# Altium project NA61_BPD_FEE_eval.PrjPcb
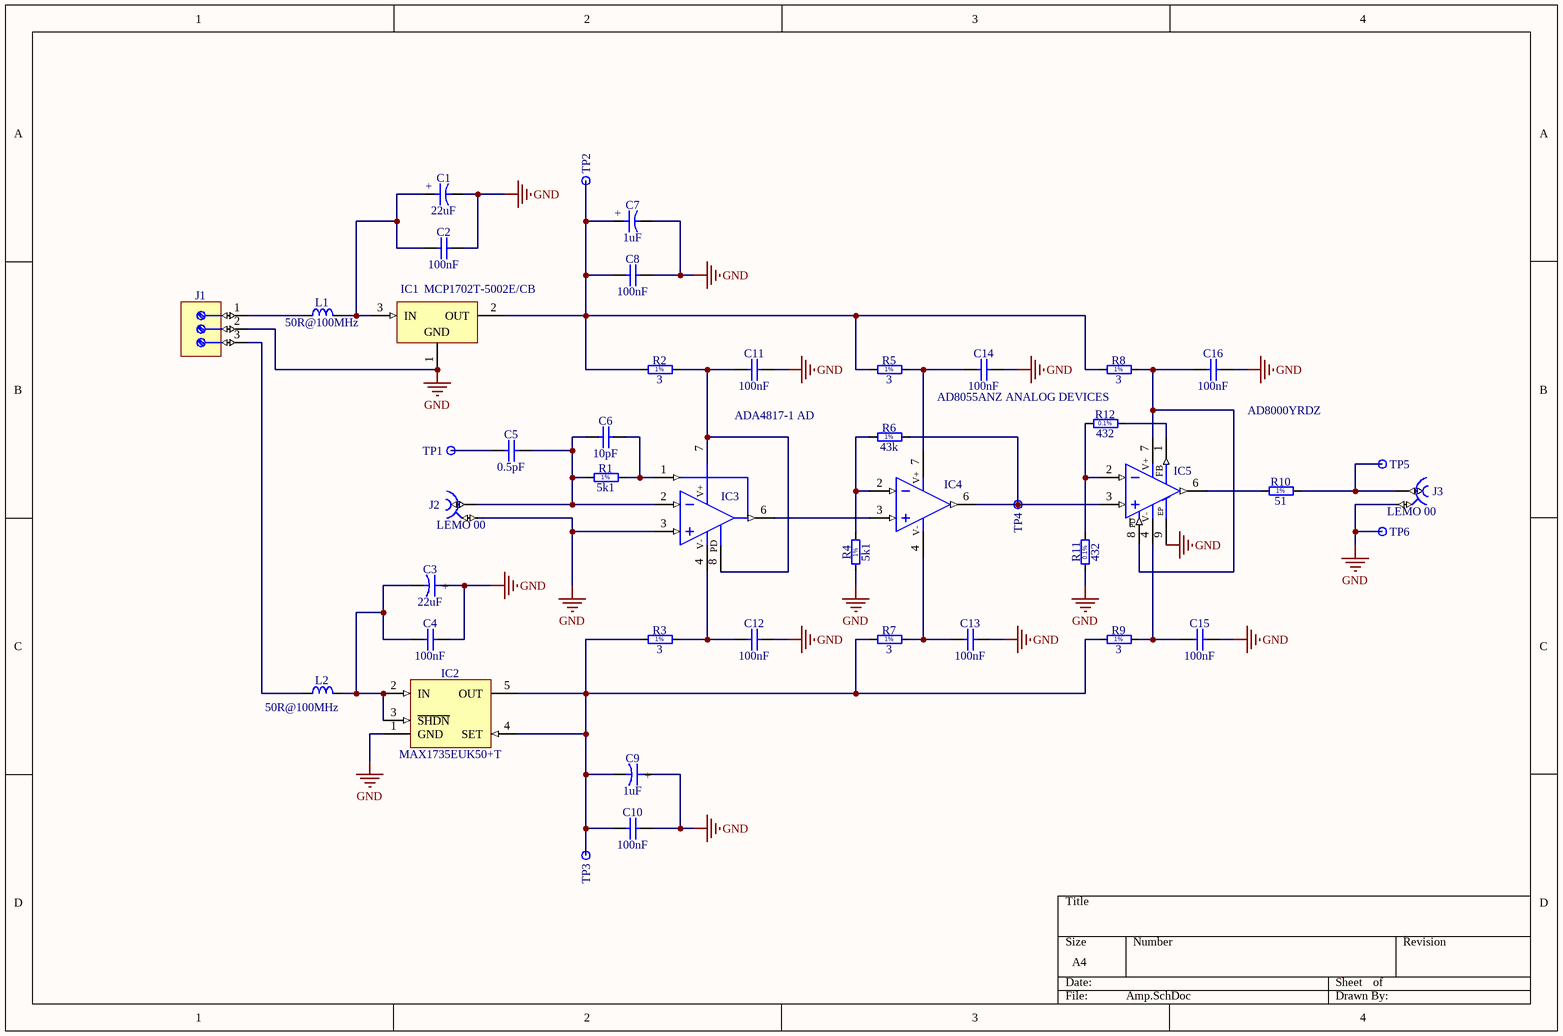
[diagram p0: Amp.SchDoc]
1 sheet, 44 parts. Net scope: global (net labels, ports and power ports of the same name join across sheets).
Board file: PCB.PcbDoc

## Sheet Amp.SchDoc
size A4

### Parts
C1  22uF  [CAPMP3216X180N]
C2  100nF  [CAPC2012X135N]
C3  22uF  [CAPMP3216X180N]
C4  100nF  [CAPC2012X135N]
C5  0.5pF  [CAPC1005X50N]
C6  10pF  [CAPC2012X135N]
C7  1uF  [CAPMP3216X180N]
C8  100nF  [CAPC2012X135N]
C9  1uF  [CAPMP3216X180N]
C10  100nF  [CAPC2012X135N]
C11  100nF  [CAPC2012X135N]
C12  100nF  [CAPC2012X135N]
C13  100nF  [CAPC2012X135N]
C14  100nF  [CAPC2012X135N]
C15  100nF  [CAPC2012X135N]
C16  100nF  [CAPC2012X135N]
IC1  MCP1702T-5002E/CB  [SOT95P255X145-3N]
IC2  MAX1735EUK50+T  [SOT95P280X145-5N]
IC3  ADA4817-1 AD  [SOIC127P600X175-9N-S229]
IC4  AD8055ANZ ANALOG DEVICES  [SOIC127P600X175-8N]
IC5  AD8000YRDZ  [SOIC127P600X175-9N-S229]
J1  Terminal  [WIELAND_25.161.0353.0]  (value not drawn)
J2  LEMO 00  [LEMO_EPK.00.250.NTN]
J3  LEMO 00  [LEMO_EPK.00.250.NTN]
L1  50R@100MHz  [IND_MURATA_BLM31PG]
L2  50R@100MHz  [IND_MURATA_BLM31PG]
R1  5k1  [RESC2012X60N]
R2  3  [RESC2012X60N]
R3  3  [RESC2012X60N]
R4  5k1  [RESC2012X60N]
R5  3  [RESC2012X60N]
R6  43k  [RESC2012X60N]
R7  3  [RESC2012X60N]
R8  3  [RESC2012X60N]
R9  3  [RESC2012X60N]
R10  51  [RESC2012X60N]
R11  432  [RESC2012X60N]
R12  432  [RESC2012X60N]
TP1  Test Point  [VERO_20-2136]  (value not drawn)
TP2  Test Point  [VERO_20-2136]  (value not drawn)
TP3  Test Point  [VERO_20-2136]  (value not drawn)
TP4  Test Point  [VERO_20-2136]  (value not drawn)
TP5  Test Point  [VERO_20-2136]  (value not drawn)
TP6  Test Point  [VERO_20-2136]  (value not drawn)

### Nets
GND: C1.2 C2.2 C3.1 C4.2 C7.2 C8.2 C9.1 C10.2 C11.2 C12.2 C13.2 C14.2 C15.2 C16.2 IC1.1(GND) IC2.1(GND) IC3.3(IN+) IC5.9(EP) J1.2 J2.2 J3.2 R4.1 R11.1 TP6.1
NetC1_1: C1.1 C2.1 IC1.3(IN) L1.2
NetC3_2: C3.2 C4.1 IC2.2(IN) IC2.3(~{SHDN}) L2.2
NetC5_1: C5.1 TP1.1
NetC5_2: C5.2 C6.1 IC3.2(IN-) J2.1 R1.1
NetC6_2: C6.2 IC3.1(FB) R1.2
NetC7_1: C7.1 C8.1 IC1.2(OUT) R2.1 R5.1 R8.1 TP2.1
NetC9_2: C9.2 C10.1 IC2.4(SET) IC2.5(OUT) R3.1 R7.1 R9.1 TP3.1
NetC11_1: C11.1 IC3.7(V+) IC3.8(PD) R2.2
NetC12_1: C12.1 IC3.4(V-) R3.2
NetC13_1: C13.1 IC4.4(V-) R7.2
NetC14_1: C14.1 IC4.7(V+) R5.2
NetC15_1: C15.1 IC5.4(V-) R9.2
NetC16_1: C16.1 IC5.7(V+) IC5.8(~{DS}) R8.2
NetIC3_6: IC3.6(OUT) IC4.3(IN+)
NetIC4_2: IC4.2(IN-) R4.2 R6.1
NetIC4_6: IC4.6(OUT) IC5.3(IN+) R6.2 TP4.1
NetIC5_1: IC5.1(FB) R12.2
NetIC5_2: IC5.2(IN-) R11.2 R12.1
NetIC5_6: IC5.6(OUT) R10.1
NetJ1_1: J1.1 L1.1
NetJ1_3: J1.3 L2.1
NetJ3_1: J3.1 R10.2 TP5.1

Not connected (* = marked no-connect by the designer): IC3 9(GND)

### Notes on the sheet
- (in symbol AD8000YRDZ) PD
- (in symbol CTE3216-18_1UF_16V_10%) +
- (in symbol CTE3216-18_22UF_10V_10%) +
- (in symbol R0805_3R_1%_0.125W_200PPM) 1%
- (in symbol R0805_5K1_1%_0.125W_100PPM) 1%
- (in symbol R0805_43K_1%_0.125W_100PPM) 1%
- (in symbol R0805_51R_1%_0.125W_100PPM) 1%
- (in symbol R0805_432R_0.1%_0.1W_10PPM) 0.1%

### Library data of the parts
C1 C3 = CTE3216-18_22UF_10V_10%: Polarised capacitor; Part Description: Solid Tantalum Chip Capacitor; Manufacturer: GENERIC; Manufacturer1 Part Number: TAJA226K010R; Voltage: 10V; Tolerance: ±10%; Part Number: CTE3216-18_22UF_10V_10%; Component Kind: Standard; Component Type: Standard; Pin Count: 2; Value: 22uF; Status: Preferred; Manufacturer Part Number: CTE3216-18_22UF_10V_10%; Case: A; Mounted: Yes; Socket: No; SMD: Yes; Sense: No; Manufacturer1 Example: AVX; Manufacturer1 ComponentHeight: 1.8mm; HelpURL: \\cern.ch\dfs\Applications\Altium\Datasheets\CTE_AVX_TAJ.pdf; Author: CERN DEM JLC; CreateDate: 03.12.2007; LatestRevisionDate: 03.12.2007
C2 C4 C8 C10-C16 = CC0805_100NF_50V_10%_X7R: Non-polarised capacitor; Part Description: SMD Multilayer Chip Ceramic Capacitor; Manufacturer: GENERIC; Manufacturer1 Part Number: C2012X7R1H104K085AA; Voltage: 50V; TC: X7R; Tolerance: ±10%; Part Number: CC0805_100NF_50V_10%_X7R; Component Kind: Standard; Component Type: Standard; Pin Count: 2; Value: 100nF; Status: Preferred; Manufacturer Part Number: CC0805_100NF_50V_10%_X7R; Case: 0805; Mounted: Yes; Socket: No; SMD: Yes; Sense: No; Manufacturer1 Example: TDK; Manufacturer1 ComponentHeight: 1mm; HelpURL: \\cern.ch\dfs\Applications\Altium\Datasheets\CC0805_X7R_TDK_C.pdf; Author: CERN DEM JLC; CreateDate: 03.12.2007; LatestRevisionDate: 22.04.2015
C5 = CC0402_0.5PF_25V_0.05PF_AVX_04023J0R5ABSTR: Non-polarised capacitor; Part Description: Thin-Film Chip Capacitors for RF Signal and Power Applications, Accu-P Series; Manufacturer: AVX; Voltage: 25V; Tolerance: ±0.05pF; Part Number: CC0402_0.5PF_25V_0.05PF_AVX_04023J0R5ABSTR; Component Kind: Standard; Component Type: Standard; Pin Count: 2; Value: 0.5pF; Status: None; Manufacturer Part Number: 04023J0R5ABSTR; Case: 0402; Mounted: Yes; Socket: No; SMD: Yes; Sense: No; ComponentHeight: 0.5mm; HelpURL: \\cern.ch\dfs\Applications\Altium\Datasheets\CC0402_AVX_ACCU-P.pdf; Author: CERN DEM JLC; CreateDate: 22.02.2017; LatestRevisionDate: 22.02.2017
C6 = CC0805_10PF_50V_1%_NP0: Non-polarised capacitor; Part Description: SMD Multilayer Chip Ceramic Capacitor; Manufacturer: GENERIC; Manufacturer1 Part Number: 223886118109; Voltage: 50V; TC: C0G/NP0; Tolerance: ±1%; Part Number: CC0805_10PF_50V_1%_NP0; Component Kind: Standard; Component Type: Standard; Pin Count: 2; Value: 10pF; Status: None; Manufacturer Part Number: CC0805_10PF_50V_1%_NP0; Case: 0805; Mounted: Yes; Socket: No; SMD: Yes; Sense: No; Manufacturer1 Example: PHYCOMP; Manufacturer1 ComponentHeight: 1.35mm; HelpURL: \\cern.ch\dfs\Applications\Altium\Datasheets\CC0805_NP0_PHYCOMP.pdf; Author: CERN DEM MR; CreateDate: 31.05.2016; LatestRevisionDate: 31.05.2016
C7 C9 = CTE3216-18_1UF_16V_10%: Polarised capacitor; Part Description: Solid Tantalum Chip Capacitor; Manufacturer: GENERIC; Manufacturer1 Part Number: TAJA105K016RNJ; Voltage: 16V; Tolerance: ±10%; Part Number: CTE3216-18_1UF_16V_10%; Component Kind: Standard; Component Type: Standard; Pin Count: 2; Value: 1uF; Status: Preferred; Manufacturer Part Number: CTE3216-18_1UF_16V_10%; Case: A; Mounted: Yes; Socket: No; SMD: Yes; Sense: No; Manufacturer1 Example: AVX; Manufacturer1 ComponentHeight: 1.8mm; HelpURL: \\cern.ch\dfs\Applications\Altium\Datasheets\CTE_AVX_TAJ.pdf; Author: CERN DEM JLC; CreateDate: 03.09.2012; LatestRevisionDate: 03.09.2012
IC1 = MCP1702T-5002E/CB: 3-Terminal Regulator 1=GND 2=OUT 3=IN; Part Description: 5V 250mA Low Quiescent Current LDO Positive Voltage Regulator; Manufacturer: MICROCHIP TECHNOLOGY; PressFit: No; Bonding: No; Part Number: MCP1702T-5002E/CB; Component Kind: Standard; Component Type: Standard; Device: MCP1702T-5002E/CB; PackageDescription: SOT, 0.95mm Pitch; 3 Pin, 1.50mm W X 2.90mm L X 1.45mm H Body, IPC Medium Density; Manufacturer Part Number: MCP1702T-5002E/CB; Pin Count: 3; Case: SOT23-3; Mounted: Yes; Socket: No; SMD: Yes; Sense: No; ComponentHeight: 1.45mm; HelpURL: \\cern.ch\dfs\Applications\Altium\Datasheets\MCP1702T-5002E-CB.pdf; Author: CERN DEM JLC; CreateDate: 16.02.2017; LatestRevisionDate: 16.02.2017
IC2 = MAX1735EUK50+T: 200mA, Negative-Output, Low-Dropout Linear Regulator; Part Description: 5V, 200mA, Negative-Output, Low-Dropout Linear Regulator; Manufacturer: MAXIM; PressFit: No; Bonding: No; Part Number: MAX1735EUK50+T; Component Kind: Standard; Component Type: Standard; Device: MAX1735EUK50+T; PackageDescription: SOT, 0.95mm pitch; 5 pin, 1.60mm W X 2.90mm L X 1.45mm H body, IPC Medium Density; Manufacturer Part Number: MAX1735EUK50+T; Pin Count: 5; Case: SOT23-5; Mounted: Yes; Socket: No; SMD: Yes; Sense: No; ComponentHeight: 1.45mm; HelpURL: \\cern.ch\dfs\Applications\Altium\Datasheets\MAX1735EUK50+T.pdf; Author: CERN DEM JLC; CreateDate: 17.02.2010; LatestRevisionDate: 17.02.2010
IC3 = ADA4817-1: Name: ADA4817-1; Manufacturer: AD
IC4 = AD8055ANZ: Part Description: Low Cost, 300 MHz Voltage Feedback Amplifier; PressFit: No; Bonding: No; Part Number: AD8055ANZ; Component Kind: Standard; Component Type: Standard; Device: AD8055ANZ; Footprint: DIP8-300; PackageDescription: DIP 8 Leads, Row Spacing 7.62 mm; Pitch 2.54 mm; Manufacturer: ANALOG DEVICES; Manufacturer Part Number: AD8055ANZ; Pin Count: 7; Case: DIP8-300; Mounted: Yes; Socket: Yes; SMD: No; Sense: No; ComponentHeight: 5.33mm; Author: CERN DEM JLC; HelpURL: \\cern.ch\dfs\Applications\Altium\Datasheets\AD8055ANZ.pdf; CreateDate: 14.03.2011; LatestRevisionDate: 14.03.2011
IC5 = AD8000YRDZ: 1.5 GHz Ultrahigh Speed Operational Amplifier; Manufacturer: ANALOG DEVICES; PressFit: No; Bonding: No; Part Number: AD8000YRDZ; Component Kind: Standard; Component Type: Standard; Device: AD8000YRDZ; PackageDescription: SOIC 8, Pitch 1.27mm - Body 4x5mm, (w/thermal tab 2.29mm X 2.29mm), IPC Medium Density; Part Description: 1.5 GHz Ultrahigh Speed Operational Amplifier; Manufacturer Part Number: AD8000YRDZ; Pin Count: 9; Case: SOIC8; Mounted: Yes; Socket: No; SMD: Yes; Sense: No; ComponentHeight: 1.75mm; Author: CERN DEM JLC; HelpURL: \\cern.ch\dfs\Applications\Altium\Datasheets\AD8000YRDZ.pdf; CreateDate: 14.05.2013; LatestRevisionDate: 14.05.2013
J1 = WIELAND_25.161.0353.0: Terminal Block, 3 Positions, Screw Connection; Part Description: 16A 250VAC 3 Way PCB Terminal Block, Pitch 5mm, Screw Connection, Wire Size Max: 2.5mm²; PressFit: No; Part Number: WIELAND_25.161.0353.0; Component Kind: Standard; Component Type: Standard; Pin Count: 3; Family: Terminal; Mounted: Yes; Socket: No; SMD: No; Sense: No; Status: None; Manufacturer: WIELAND; Manufacturer Part Number: 25.161.0353.0; ComponentHeight: 15mm; HelpURL: \\cern.ch\dfs\Applications\Altium\Datasheets\WIELAND_25.161.0353.0.pdf; Author: CERN DEM JLC; CreateDate: 02.06.2009; LatestRevisionDate: 02.06.2009
J2 J3 = LEMO_EPK.00.250.NTN: Part Description: Size 00, 50 Ohms Coaxial Elbow (90°) socket With Clearance Under The Body; PressFit: No; SCEM: 09.46.11.180.6; Part Number: LEMO_EPK.00.250.NTN; Component Kind: Standard; Component Type: Standard; Pin Count: 2; Family: LEMO 00; Mounted: Yes; Socket: No; SMD: No; Sense: No; Status: None; Manufacturer: LEMO; Manufacturer Part Number: EPK.00.250.NTN; ComponentHeight: 7mm; HelpURL: \\cern.ch\dfs\Applications\Altium\Datasheets\LEMO_EPK.00.250.NTN.pdf; Author: CERN DEM JLC; CreateDate: 04.09.2012; LatestRevisionDate: 04.09.2012
L1 L2 = IND1206_MURATA_BLM31PG500SN1: Inductor; Part Description: SMD EMIFIL Chip Ferrite Bead; Manufacturer: MURATA; Power: 3.5A; Resistance: 0.015R; Part Number: IND1206_MURATA_BLM31PG500SN1; Component Kind: Standard; Component Type: Standard; Pin Count: 2; Value: 50R@100MHz; Status: None; Manufacturer Part Number: BLM31PG500SN1; Case: 1206; Mounted: Yes; Socket: No; SMD: Yes; Sense: No; ComponentHeight: 1.3mm; HelpURL: \\cern.ch\dfs\Applications\Altium\Datasheets\IND1206_MURATA_BLM31P.pdf; Author: CERN DEM JLC; CreateDate: 05.12.2013; LatestRevisionDate: 05.12.2013
R1 R4 = R0805_5K1_1%_0.125W_100PPM: Resistor - 1%; Part Description: General Purpose Thick Film Chip Resistor; Manufacturer: GENERIC; Manufacturer1 Part Number: NRC10F5101TRF; Power: 0.125W; TC: ±100ppm/°C; PressFit: No; Part Number: R0805_5K1_1%_0.125W_100PPM; Component Kind: Standard; Component Type: Standard; Pin Count: 2; Value: 5k1; Status: Preferred; Tolerance: ±1%; Manufacturer Part Number: R0805_5K1_1%_0.125W_100PPM; Case: 0805; Mounted: Yes; Sense: No; Socket: No; SMD: Yes; Manufacturer1 Example: NIC COMPONENT; Manufacturer1 ComponentHeight: 0.6mm; HelpURL: \\cern.ch\dfs\Applications\Altium\Datasheets\R0805_NIC_NRC.pdf; Author: CERN DEM JLC; CreateDate: 03.12.2007; LatestRevisionDate: 13.03.2008
R2 R3 R5 R7-R9 = R0805_3R_1%_0.125W_200PPM: Resistor - 1%; Part Description: General Purpose Thick Film Chip Resistor; Manufacturer: GENERIC; Manufacturer1 Part Number: 232273463008L or RC0805FR-073RL; Power: 0.125W; TC: ±200ppm/°C; PressFit: No; Part Number: R0805_3R_1%_0.125W_200PPM; Component Kind: Standard; Component Type: Standard; Pin Count: 2; Value: 3; Status: Preferred; Tolerance: ±1%; Manufacturer Part Number: R0805_3R_1%_0.125W_200PPM; Case: 0805; Mounted: Yes; Sense: No; Socket: No; SMD: Yes; Manufacturer1 Example: YAGEO PHYCOMP; Manufacturer1 ComponentHeight: 0.65mm; HelpURL: \\cern.ch\dfs\Applications\Altium\Datasheets\R0805_Phycomp_RC0805.pdf; Author: CERN DEM JLC; CreateDate: 03.12.2007; LatestRevisionDate: 17.10.2012
R6 = R0805_43K_1%_0.125W_100PPM: Resistor - 1%; Part Description: General Purpose Thick Film Chip Resistor; Manufacturer: GENERIC; Manufacturer1 Part Number: NRC10F4302TRF; Power: 0.125W; TC: ±100ppm/°C; PressFit: No; Part Number: R0805_43K_1%_0.125W_100PPM; Component Kind: Standard; Component Type: Standard; Pin Count: 2; Value: 43k; Status: Preferred; Tolerance: ±1%; Manufacturer Part Number: R0805_43K_1%_0.125W_100PPM; Case: 0805; Mounted: Yes; Sense: No; Socket: No; SMD: Yes; Manufacturer1 Example: NIC COMPONENT; Manufacturer1 ComponentHeight: 0.6mm; HelpURL: \\cern.ch\dfs\Applications\Altium\Datasheets\R0805_NIC_NRC.pdf; Author: CERN DEM JLC; CreateDate: 03.12.2007; LatestRevisionDate: 13.03.2008
R10 = R0805_51R_1%_0.125W_100PPM: Resistor - 1%; Part Description: General Purpose Thick Film Chip Resistor; Manufacturer: GENERIC; Manufacturer1 Part Number: NRC10F51R0TRF; Power: 0.125W; TC: ±100ppm/°C; PressFit: No; Part Number: R0805_51R_1%_0.125W_100PPM; Component Kind: Standard; Component Type: Standard; Pin Count: 2; Value: 51; Status: Preferred; Tolerance: ±1%; Manufacturer Part Number: R0805_51R_1%_0.125W_100PPM; Case: 0805; Mounted: Yes; Sense: No; Socket: No; SMD: Yes; Manufacturer1 Example: NIC COMPONENT; Manufacturer1 ComponentHeight: 0.6mm; HelpURL: \\cern.ch\dfs\Applications\Altium\Datasheets\R0805_NIC_NRC.pdf; Author: CERN DEM JLC; CreateDate: 03.12.2007; LatestRevisionDate: 13.03.2008
R11 R12 = R0805_432R_0.1%_0.1W_10PPM: Resistor - 0.1%; Part Description: Thin Film Chip Resistor; Manufacturer: GENERIC; Manufacturer1 Part Number: RN73C2A432RBTG; Power: 0.1W; TC: ±10ppm; PressFit: No; Part Number: R0805_432R_0.1%_0.1W_10PPM; Component Kind: Standard; Component Type: Standard; Pin Count: 2; Value: 432; Status: Not Recommended; Tolerance: ±0.1%; Manufacturer Part Number: R0805_432R_0.1%_0.1W_10PPM; Case: 0805; Mounted: Yes; Sense: No; Socket: No; SMD: Yes; Manufacturer1 Example: TYCO HOLSWORTHY; Manufacturer1 ComponentHeight: 0.6mm; HelpURL: \\cern.ch\dfs\Applications\Altium\Datasheets\R0805_Tyco_RN73.pdf; Author: CERN DEM JLC; CreateDate: 03.12.2007; LatestRevisionDate: 13.03.2008
TP1-TP6 = VERO_20-2136: Part Description: Black Bead PCB Terminal Test Pin for 1.6mm PCB Thickness (1.32mm Hole); Manufacturer: VERO TECHNOLOGIES; PressFit: No; Part Number: VERO_20-2136; Component Kind: Standard; Component Type: Standard; Pin Count: 1; Family: Test Point; Mounted: Yes; Socket: No; SMD: No; Sense: No; Status: None; Manufacturer Part Number: 20-2136; ComponentHeight: 5.3mm; HelpURL: \\cern.ch\dfs\Applications\Altium\Datasheets\VERO_20-2136.pdf; Author: CERN DEM JLC; CreateDate: 21.07.2008; LatestRevisionDate: 15.07.2013

## Assembly variants
Assembly: not fitted C9 C10 J2